# Altium schematic sheet DIO.SCHDOC
size B
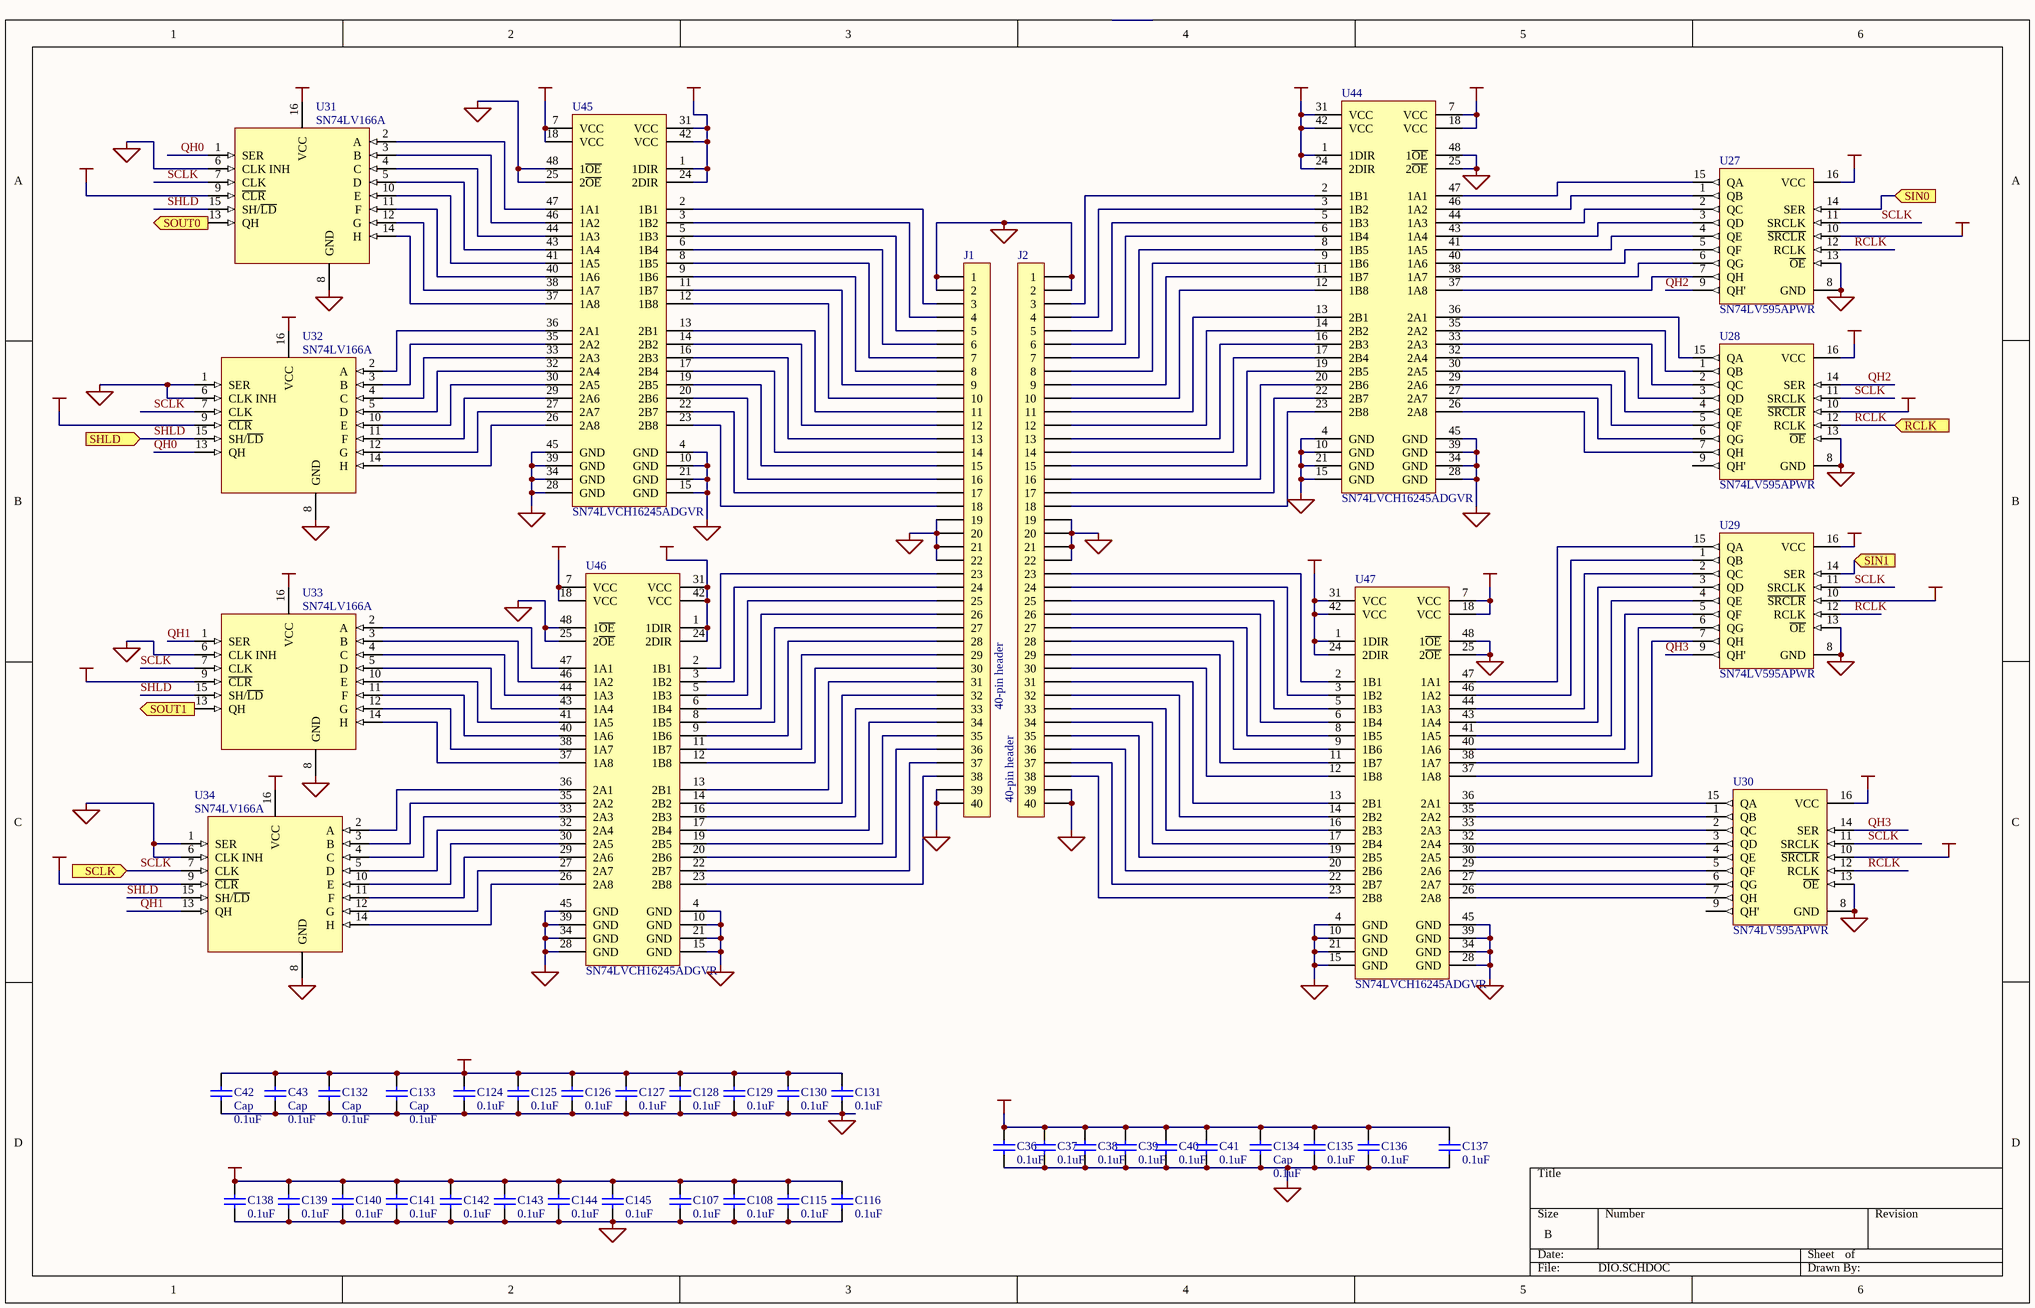
[diagram p0: DIO.SCHDOC]

## Parts
C36  value 0.1uF  [CC1608-0603]  (hidden comment: Cap)
C37  value 0.1uF  [CC1608-0603]  (hidden comment: Cap)
C38  value 0.1uF  [CC1608-0603]  (hidden comment: Cap)
C39  value 0.1uF  [CC1608-0603]  (hidden comment: Cap)
C40  value 0.1uF  [CC1608-0603]  (hidden comment: Cap)
C41  value 0.1uF  [CC1608-0603]  (hidden comment: Cap)
C42  Cap  value 0.1uF  [CC1608-0603]
C43  Cap  value 0.1uF  [CC1608-0603]
C107  value 0.1uF  [CC1608-0603]  (hidden comment: Cap)
C108  value 0.1uF  [CC1608-0603]  (hidden comment: Cap)
C115  value 0.1uF  [CC1608-0603]  (hidden comment: Cap)
C116  value 0.1uF  [CC1608-0603]  (hidden comment: Cap)
C124  value 0.1uF  [CC1608-0603]  (hidden comment: Cap)
C125  value 0.1uF  [CC1608-0603]  (hidden comment: Cap)
C126  value 0.1uF  [CC1608-0603]  (hidden comment: Cap)
C127  value 0.1uF  [CC1608-0603]  (hidden comment: Cap)
C128  value 0.1uF  [CC1608-0603]  (hidden comment: Cap)
C129  value 0.1uF  [CC1608-0603]  (hidden comment: Cap)
C130  value 0.1uF  [CC1608-0603]  (hidden comment: Cap)
C131  value 0.1uF  [CC1608-0603]  (hidden comment: Cap)
C132  Cap  value 0.1uF  [CC1608-0603]
C133  Cap  value 0.1uF  [CC1608-0603]
C134  Cap  value 0.1uF  [CC1608-0603]
C135  value 0.1uF  [CC1608-0603]  (hidden comment: Cap)
C136  value 0.1uF  [CC1608-0603]  (hidden comment: Cap)
C137  value 0.1uF  [CC1608-0603]  (hidden comment: Cap)
C138  value 0.1uF  [CC1608-0603]  (hidden comment: Cap)
C139  value 0.1uF  [CC1608-0603]  (hidden comment: Cap)
C140  value 0.1uF  [CC1608-0603]  (hidden comment: Cap)
C141  value 0.1uF  [CC1608-0603]  (hidden comment: Cap)
C142  value 0.1uF  [CC1608-0603]  (hidden comment: Cap)
C143  value 0.1uF  [CC1608-0603]  (hidden comment: Cap)
C144  value 0.1uF  [CC1608-0603]  (hidden comment: Cap)
C145  value 0.1uF  [CC1608-0603]  (hidden comment: Cap)
J1  40-pin header  [HDR2X20]
J2  40-pin header  [HDR2X20]
U27  SN74LV595APWR  [SSO-G16/X.4]
U28  SN74LV595APWR  [SSO-G16/X.4]
U29  SN74LV595APWR  [SSO-G16/X.4]
U30  SN74LV595APWR  [SSO-G16/X.4]
U31  SN74LV166A  [SSO-G16/X.4]
U32  SN74LV166A  [SSO-G16/X.4]
U33  SN74LV166A  [SSO-G16/X.4]
U34  SN74LV166A  [SSO-G16/X.4]
U44  SN74LVCH16245ADGVR  [TSSO10X6-G48-0.4]
U45  SN74LVCH16245ADGVR  [TSSO10X6-G48-0.4]
U46  SN74LVCH16245ADGVR  [TSSO10X6-G48-0.4]
U47  SN74LVCH16245ADGVR  [TSSO10X6-G48-0.4]

## Ports
RCLK (in), SCLK (in), SHLD (in), SIN0 (in), SIN1 (in), SOUT0 (out), SOUT1 (out)

## Nets
+5VCC: C36.2 C37.2 C38.2 C39.2 C40.2 C41.2 C134.2 C135.2 C136.2 C137.1 U44.7(VCC) U44.18(VCC) U45.7(VCC) U45.18(VCC) U46.7(VCC) U46.18(VCC) U47.7(VCC) U47.18(VCC)
GND: C36.1 C37.1 C38.1 C39.1 C40.1 C41.1 C42.2 C43.2 C107.1 C108.1 C115.1 C116.1 C124.1 C125.1 C126.1 C127.1 C128.1 C129.1 C130.1 C131.1 C132.2 C133.2 C134.1 C135.1 C136.1 C137.2 C138.1 C139.1 C140.1 C141.1 C142.1 C143.1 C144.1 C145.1 J1.1 J1.2 J1.19 J1.20 J1.21 J1.22 J1.39 J1.40 J2.1 J2.2 J2.19 J2.20 J2.21 J2.22 J2.39 J2.40 U27.8(GND) U27.13(~{OE}) U28.8(GND) U28.13(~{OE}) U29.8(GND) U29.13(~{OE}) U30.8(GND) U30.13(~{OE}) U31.6(CLK_INH) U31.8(GND) U32.1(SER) U32.6(CLK_INH) U32.8(GND) U33.6(CLK_INH) U33.8(GND) U34.1(SER) U34.6(CLK_INH) U34.8(GND) U44.4(GND) U44.10(GND) U44.15(GND) U44.21(GND) U44.25(2~{OE}) U44.28(GND) U44.34(GND) U44.39(GND) U44.45(GND) U44.48(1~{OE}) U45.4(GND) U45.10(GND) U45.15(GND) U45.21(GND) U45.25(2~{OE}) U45.28(GND) U45.34(GND) U45.39(GND) U45.45(GND) U45.48(1~{OE}) U46.4(GND) U46.10(GND) U46.15(GND) U46.21(GND) U46.25(2~{OE}) U46.28(GND) U46.34(GND) U46.39(GND) U46.45(GND) U46.48(1~{OE}) U47.4(GND) U47.10(GND) U47.15(GND) U47.21(GND) U47.25(2~{OE}) U47.28(GND) U47.34(GND) U47.39(GND) U47.45(GND) U47.48(1~{OE})
VCC: C42.1 C43.1 C107.2 C108.2 C115.2 C116.2 C124.2 C125.2 C126.2 C127.2 C128.2 C129.2 C130.2 C131.2 C132.1 C133.1 C138.2 C139.2 C140.2 C141.2 C142.2 C143.2 C144.2 C145.2 U27.10(~{SRCLR}) U27.16(VCC) U28.10(~{SRCLR}) U28.16(VCC) U29.10(~{SRCLR}) U29.16(VCC) U30.10(~{SRCLR}) U30.16(VCC) U31.9(~{CLR}) U31.16(VCC) U32.9(~{CLR}) U32.16(VCC) U33.9(~{CLR}) U33.16(VCC) U34.9(~{CLR}) U34.16(VCC) U44.1(1DIR) U44.24(2DIR) U44.31(VCC) U44.42(VCC) U45.1(1DIR) U45.24(2DIR) U45.31(VCC) U45.42(VCC) U46.1(1DIR) U46.24(2DIR) U46.31(VCC) U46.42(VCC) U47.1(1DIR) U47.24(2DIR) U47.31(VCC) U47.42(VCC)
QH0: U31.1(SER) U32.13(QH)
QH1: U33.1(SER) U34.13(QH)
QH2: U27.9(QH') U28.14(SER)
QH3: U29.9(QH') U30.14(SER)
RCLK: U27.12(RCLK) U28.12(RCLK) U29.12(RCLK) U30.12(RCLK) ; port RCLK
SCLK: U27.11(SRCLK) U28.11(SRCLK) U29.11(SRCLK) U30.11(SRCLK) U31.7(CLK) U32.7(CLK) U33.7(CLK) U34.7(CLK) ; port SCLK
SHLD: U31.15(SH/~{LD}) U32.15(SH/~{LD}) U33.15(SH/~{LD}) U34.15(SH/~{LD}) ; port SHLD
SIN0: U27.14(SER) ; port SIN0
SIN1: U29.14(SER) ; port SIN1
SOUT0: U31.13(QH) ; port SOUT0
SOUT1: U33.13(QH) ; port SOUT1
NetJ1_3: J1.3 U45.2(1B1)
NetJ1_4: J1.4 U45.3(1B2)
NetJ1_5: J1.5 U45.5(1B3)
NetJ1_6: J1.6 U45.6(1B4)
NetJ1_7: J1.7 U45.8(1B5)
NetJ1_8: J1.8 U45.9(1B6)
NetJ1_9: J1.9 U45.11(1B7)
NetJ1_10: J1.10 U45.12(1B8)
NetJ1_11: J1.11 U45.13(2B1)
NetJ1_12: J1.12 U45.14(2B2)
NetJ1_13: J1.13 U45.16(2B3)
NetJ1_14: J1.14 U45.17(2B4)
NetJ1_15: J1.15 U45.19(2B5)
NetJ1_16: J1.16 U45.20(2B6)
NetJ1_17: J1.17 U45.22(2B7)
NetJ1_18: J1.18 U45.23(2B8)
NetJ1_23: J1.23 U46.2(1B1)
NetJ1_24: J1.24 U46.3(1B2)
NetJ1_25: J1.25 U46.5(1B3)
NetJ1_26: J1.26 U46.6(1B4)
NetJ1_27: J1.27 U46.8(1B5)
NetJ1_28: J1.28 U46.9(1B6)
NetJ1_29: J1.29 U46.11(1B7)
NetJ1_30: J1.30 U46.12(1B8)
NetJ1_31: J1.31 U46.13(2B1)
NetJ1_32: J1.32 U46.14(2B2)
NetJ1_33: J1.33 U46.16(2B3)
NetJ1_34: J1.34 U46.17(2B4)
NetJ1_35: J1.35 U46.19(2B5)
NetJ1_36: J1.36 U46.20(2B6)
NetJ1_37: J1.37 U46.22(2B7)
NetJ1_38: J1.38 U46.23(2B8)
NetJ2_3: J2.3 U44.2(1B1)
NetJ2_4: J2.4 U44.3(1B2)
NetJ2_5: J2.5 U44.5(1B3)
NetJ2_6: J2.6 U44.6(1B4)
NetJ2_7: J2.7 U44.8(1B5)
NetJ2_8: J2.8 U44.9(1B6)
NetJ2_9: J2.9 U44.11(1B7)
NetJ2_10: J2.10 U44.12(1B8)
NetJ2_11: J2.11 U44.13(2B1)
NetJ2_12: J2.12 U44.14(2B2)
NetJ2_13: J2.13 U44.16(2B3)
NetJ2_14: J2.14 U44.17(2B4)
NetJ2_15: J2.15 U44.19(2B5)
NetJ2_16: J2.16 U44.20(2B6)
NetJ2_17: J2.17 U44.22(2B7)
NetJ2_18: J2.18 U44.23(2B8)
NetJ2_23: J2.23 U47.2(1B1)
NetJ2_24: J2.24 U47.3(1B2)
NetJ2_25: J2.25 U47.5(1B3)
NetJ2_26: J2.26 U47.6(1B4)
NetJ2_27: J2.27 U47.8(1B5)
NetJ2_28: J2.28 U47.9(1B6)
NetJ2_29: J2.29 U47.11(1B7)
NetJ2_30: J2.30 U47.12(1B8)
NetJ2_31: J2.31 U47.13(2B1)
NetJ2_32: J2.32 U47.14(2B2)
NetJ2_33: J2.33 U47.16(2B3)
NetJ2_34: J2.34 U47.17(2B4)
NetJ2_35: J2.35 U47.19(2B5)
NetJ2_36: J2.36 U47.20(2B6)
NetJ2_37: J2.37 U47.22(2B7)
NetJ2_38: J2.38 U47.23(2B8)
NetU27_1: U27.1(QB) U44.46(1A2)
NetU27_2: U27.2(QC) U44.44(1A3)
NetU27_3: U27.3(QD) U44.43(1A4)
NetU27_4: U27.4(QE) U44.41(1A5)
NetU27_5: U27.5(QF) U44.40(1A6)
NetU27_6: U27.6(QG) U44.38(1A7)
NetU27_7: U27.7(QH) U44.37(1A8)
NetU27_15: U27.15(QA) U44.47(1A1)
NetU28_1: U28.1(QB) U44.35(2A2)
NetU28_2: U28.2(QC) U44.33(2A3)
NetU28_3: U28.3(QD) U44.32(2A4)
NetU28_4: U28.4(QE) U44.30(2A5)
NetU28_5: U28.5(QF) U44.29(2A6)
NetU28_6: U28.6(QG) U44.27(2A7)
NetU28_7: U28.7(QH) U44.26(2A8)
NetU28_15: U28.15(QA) U44.36(2A1)
NetU29_1: U29.1(QB) U47.46(1A2)
NetU29_2: U29.2(QC) U47.44(1A3)
NetU29_3: U29.3(QD) U47.43(1A4)
NetU29_4: U29.4(QE) U47.41(1A5)
NetU29_5: U29.5(QF) U47.40(1A6)
NetU29_6: U29.6(QG) U47.38(1A7)
NetU29_7: U29.7(QH) U47.37(1A8)
NetU29_15: U29.15(QA) U47.47(1A1)
NetU30_1: U30.1(QB) U47.35(2A2)
NetU30_2: U30.2(QC) U47.33(2A3)
NetU30_3: U30.3(QD) U47.32(2A4)
NetU30_4: U30.4(QE) U47.30(2A5)
NetU30_5: U30.5(QF) U47.29(2A6)
NetU30_6: U30.6(QG) U47.27(2A7)
NetU30_7: U30.7(QH) U47.26(2A8)
NetU30_15: U30.15(QA) U47.36(2A1)
NetU31_2: U31.2(A) U45.47(1A1)
NetU31_3: U31.3(B) U45.46(1A2)
NetU31_4: U31.4(C) U45.44(1A3)
NetU31_5: U31.5(D) U45.43(1A4)
NetU31_10: U31.10(E) U45.41(1A5)
NetU31_11: U31.11(F) U45.40(1A6)
NetU31_12: U31.12(G) U45.38(1A7)
NetU31_14: U31.14(H) U45.37(1A8)
NetU32_2: U32.2(A) U45.36(2A1)
NetU32_3: U32.3(B) U45.35(2A2)
NetU32_4: U32.4(C) U45.33(2A3)
NetU32_5: U32.5(D) U45.32(2A4)
NetU32_10: U32.10(E) U45.30(2A5)
NetU32_11: U32.11(F) U45.29(2A6)
NetU32_12: U32.12(G) U45.27(2A7)
NetU32_14: U32.14(H) U45.26(2A8)
NetU33_2: U33.2(A) U46.47(1A1)
NetU33_3: U33.3(B) U46.46(1A2)
NetU33_4: U33.4(C) U46.44(1A3)
NetU33_5: U33.5(D) U46.43(1A4)
NetU33_10: U33.10(E) U46.41(1A5)
NetU33_11: U33.11(F) U46.40(1A6)
NetU33_12: U33.12(G) U46.38(1A7)
NetU33_14: U33.14(H) U46.37(1A8)
NetU34_2: U34.2(A) U46.36(2A1)
NetU34_3: U34.3(B) U46.35(2A2)
NetU34_4: U34.4(C) U46.33(2A3)
NetU34_5: U34.5(D) U46.32(2A4)
NetU34_10: U34.10(E) U46.30(2A5)
NetU34_11: U34.11(F) U46.29(2A6)
NetU34_12: U34.12(G) U46.27(2A7)
NetU34_14: U34.14(H) U46.26(2A8)

Not connected (* = marked no-connect by the designer): U28 9(QH'); U30 9(QH')

## Library data of the parts
C36-C43 C107 C108 C115 C116 C124-C145 = Cap: Capacitor; Manufacturer: Generic Components; Class I: Passive; Published: 8-Jun-2000; Revision: July-2002: Re-released for DXP Platform.; Publisher: Altium Limited; Class II: Capacitor
J1 J2 = 40PINHEADER: Simple 40pin connector
U27-U30 = SN74LV595APWR: 8-bit shift register with 3-state output
U31-U34 = SN74LV166APWR: 8-bit parallel-load shift register
U44-U47 = SN74LVCH16245A: 16-bit bus transceiver with 3-state outputs